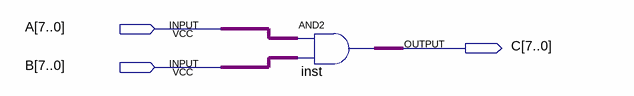
[diagram p0: schematic sheet]
// Quartus schematic EightBitAnd.bdf as structural Verilog: 1 symbols, 3 pins
module EightBitAnd (
  input  [7:0] A,
  input  [7:0] B,
  output [7:0] C
);

  assign C = A & B;  // AND2 inst, 8 bits wide
endmodule
